# Altium schematic sheet Mechanical.SchDoc
size A4; Organization: Deutsches Zentrum für Luft-; Address1: und Raumfahrt e.V. (DLR); Address2: Institut für Materialphysik; Address3: im Weltraum; Address4: Linder Höhe - 51147 Köln; DocumentNumber: 4; SheetNumber: 5; SheetTotal: 6
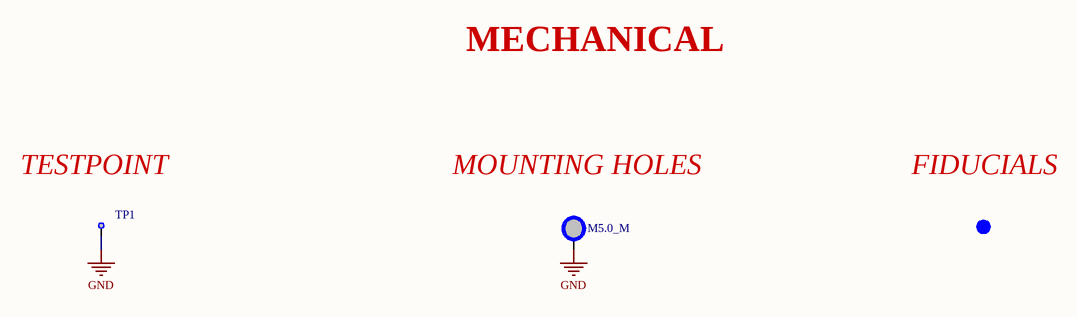
[diagram p0: Mechanical.SchDoc]

## Parts
Drill1  M5.0_M  [M5.0_M]  (no BOM)
FIID1  Fiducial  [Fiducial]  (value not drawn)  (no BOM)
TP1  Testpoint  [Testpoint]  (value not drawn)  (no BOM)

## Nets
GND: Drill1.1 TP1.1

## Notes on the sheet
- MECHANICAL
- (near TP1) TESTPOINT
- MOUNTING HOLES
- (near FIID1) FIDUCIALS
- Title
- Size:
- Date:
- A4
- Number:
- Time:
- Revision:
- Sheet
- of
- File:

## Library data of the parts
Drill1 = Drill